# EAGLE design draaibank_2 sidesv2 (EAGLE 9.6.2)
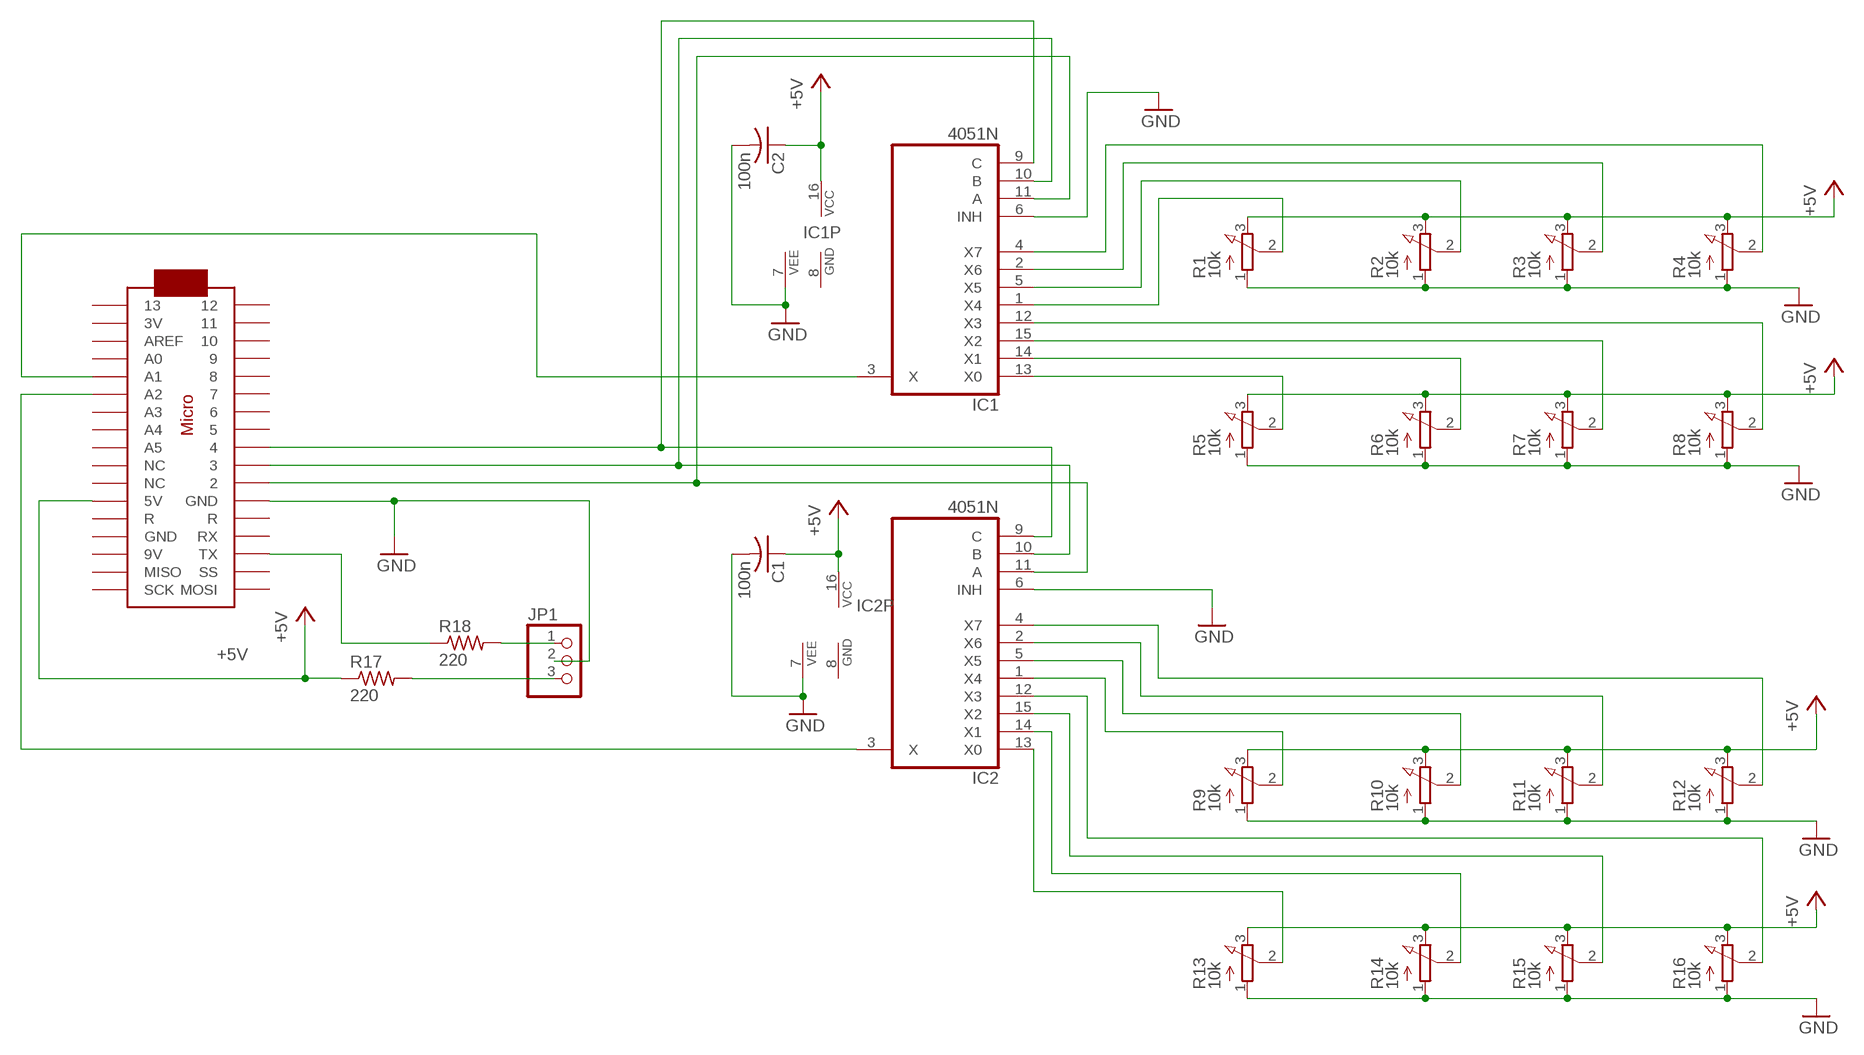
[diagram p0: schematic, sheet 1]

## Parts
C1  100n  C-USC0805  [C0805]
C2  100n  C-USC0805  [C0805]
IC1  4051N  [DIL16]
IC2  4051N  [DIL16]
JP1  PINHD-1X3  [1X03]
R1  10k  EVUF2A  [EVUF]
R2  10k  EVUF2A  [EVUF]
R3  10k  EVUF2A  [EVUF]
R4  10k  EVUF2A  [EVUF]
R5  10k  EVUF2A  [EVUF]
R6  10k  EVUF2A  [EVUF]
R7  10k  EVUF2A  [EVUF]
R8  10k  EVUF2A  [EVUF]
R9  10k  EVUF2A  [EVUF]
R10  10k  EVUF2A  [EVUF]
R11  10k  EVUF2A  [EVUF]
R12  10k  EVUF2A  [EVUF]
R13  10k  EVUF2A  [EVUF]
R14  10k  EVUF2A  [EVUF]
R15  10k  EVUF2A  [EVUF]
R16  10k  EVUF2A  [EVUF]
R17  220  R-US_R0603  [R0603]
R18  220  R-US_R0603  [R0603]
U$1  ARDUINOMICRO  [ARDUINOMICRO]

## Nets
+5V: C1.1 C2.1 IC1.16(VCC) IC2.16(VCC) R1.3(E) R2.3(E) R3.3(E) R4.3(E) R5.3(E) R6.3(E) R7.3(E) R8.3(E) R9.3(E) R10.3(E) R11.3(E) R12.3(E) R13.3(E) R14.3(E) R15.3(E) R16.3(E) R17.1 U$1.P$23(5V)
GND: C1.2 C2.2 IC1.6(INH) IC1.7(VEE) IC2.6(INH) IC2.7(VEE) JP1.2 R1.1(A) R2.1(A) R3.1(A) R4.1(A) R5.1(A) R6.1(A) R7.1(A) R8.1(A) R9.1(A) R10.1(A) R11.1(A) R12.1(A) R13.1(A) R14.1(A) R15.1(A) R16.1(A) U$1.P$21(GND)
N$1: IC2.13(X0) R13.2(S)
N$2: IC2.14(X1) R14.2(S)
N$3: IC2.15(X2) R15.2(S)
N$4: IC2.12(X3) R16.2(S)
N$5: IC2.1(X4) R9.2(S)
N$6: IC2.5(X5) R10.2(S)
N$7: IC2.2(X6) R11.2(S)
N$8: IC2.4(X7) R12.2(S)
N$9: IC1.13(X0) R5.2(S)
N$10: IC1.14(X1) R6.2(S)
N$11: IC1.15(X2) R7.2(S)
N$12: IC1.12(X3) R8.2(S)
N$13: IC1.1(X4) R1.2(S)
N$14: IC1.5(X5) R2.2(S)
N$15: IC1.2(X6) R3.2(S)
N$16: IC1.4(X7) R4.2(S)
N$17: IC1.11(A) IC2.11(A) U$1.P$11
N$18: IC1.10(B) IC2.10(B) U$1.P$10
N$19: IC1.9(C) IC2.9(C) U$1.P$9
N$20: R18.1 U$1.P$15(TX)
N$21: JP1.1 R18.2
N$22: JP1.3 R17.2
N$23: IC1.3(X) U$1.P$30(A1)
N$24: IC2.3(X) U$1.P$29(A2)
Unconnected: U$1.P$1 U$1.P$2 U$1.P$3 U$1.P$4 U$1.P$5 U$1.P$6 U$1.P$7 U$1.P$8 U$1.P$12(GND) U$1.P$13(R) U$1.P$14(RX) U$1.P$16(SS) U$1.P$17(MOSI) U$1.P$18(SCK) U$1.P$19(MISO) U$1.P$20(9V) U$1.P$22(R) U$1.P$24(NC) U$1.P$25(NC) U$1.P$26(A5) U$1.P$27(A4) U$1.P$28(A3) U$1.P$31(A0) U$1.P$32(AREF) U$1.P$33(3V) U$1.P$34

## Power pins joined to a net without a drawn wire
GND: IC1.8(GND) IC2.8(GND)

## Library data of the parts
C1 C2 = adafruit:C-US: CAPACITOR, American symbol
IC1 IC2 = 40xx:4051: 8-channel ANALOG MULTIPLEXER
JP1 = pinhead:PINHD-1X3: PIN HEADER
R1-R16 = pot:EVU: 9 mm Square Rotary Potentiometers Source: Panasonic
R17 R18 = adafruit:R-US_: RESISTOR, American symbol
U$1 = adafruit:ARDUINOMICRO

## Board
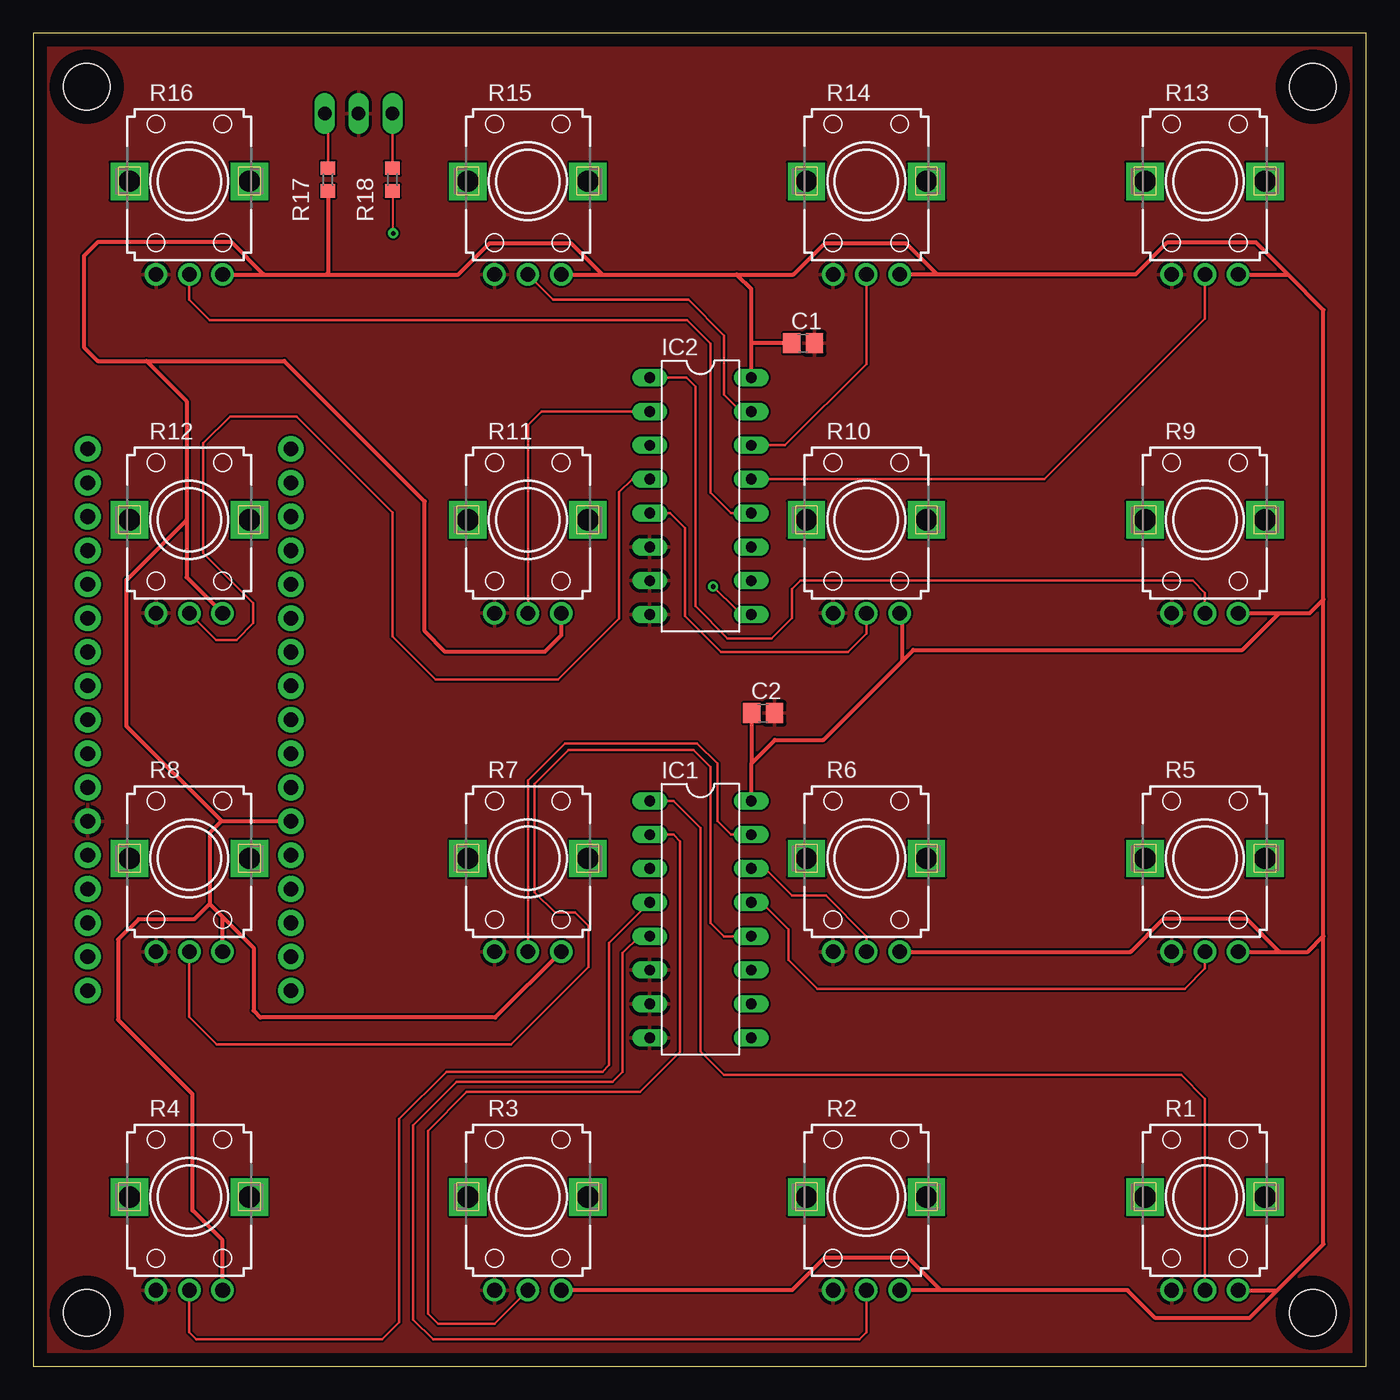
[diagram p1: board, top side]
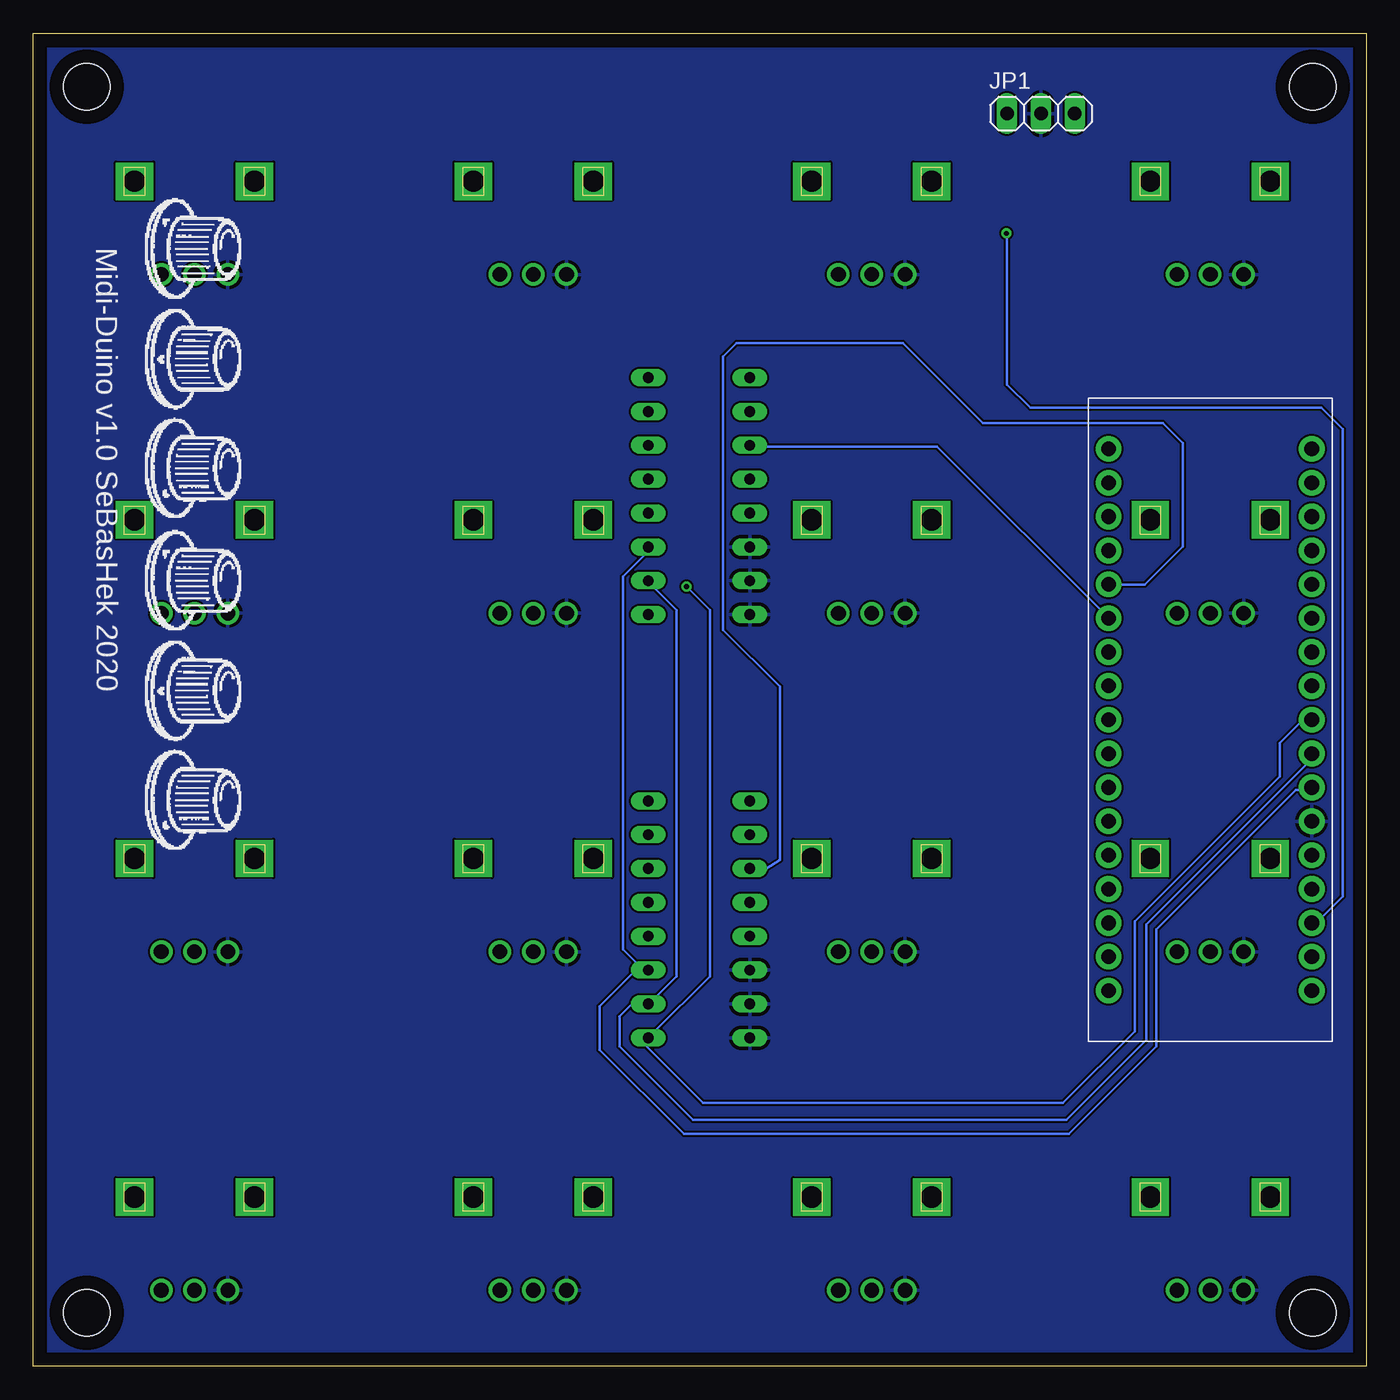
[diagram p2: board, bottom side, seen from below]

Size 100 x 100 mm. Coordinates in mm from the lower left corner, seen from the top.
Outline: 0,0 100,0 100,100 0,100 0,0
Copper layers (1*16): Top 0.035mm / dielectric 1.5mm / Bottom 0.035mm
Design rules "default *": minimum track width 6mil, minimum drill 0.35mm, track to track 6mil, track to pad 6mil, pad to pad 6mil, via to via 6mil, smd to smd 6mil, copper to edge 40mil, drill to drill 6mil, minimum pad ring 10mil, minimum via ring 8mil, stop-mask expansion 4mil, vias tented up to drill 0mil, thermal gap 10mil
Holes 3.5 mm at 4,96 96,96 96,4 4,4

### Footprints (pad centres in the part's own frame; a part is rotated, then mirrored left to right if it is on the bottom)
C0805 = smd 1.3 x 1.5: 1 -0.85,0; 2 0.85,0
DIL16 = drill 0.813 long: 1 -8.89,-3.81; 2 -6.35,-3.81; 3 -3.81,-3.81; 4 -1.27,-3.81; 5 1.27,-3.81; 6 3.81,-3.81; 7 6.35,-3.81; 8 8.89,-3.81; 9 8.89,3.81; 10 6.35,3.81; 11 3.81,3.81; 12 1.27,3.81; 13 -1.27,3.81; 14 -3.81,3.81; 15 -6.35,3.81; 16 -8.89,3.81
1X03 = drill 1.016 long: 1 -2.54,0; 2 0,0; 3 2.54,0
EVUF = drill 1.1 pad 1.676: 1 -2.5,-7; 2 0,-7; 3 2.5,-7 | drill 1.6 pad 2.8 square: M1 4.5,0; M2 -4.5,0
R0603 = smd 1 x 1.1: 1 -0.85,0; 2 0.85,0
ARDUINOMICRO = drill 1.1 pad 1.93: P$1 -20.32,7.62; P$2 -17.78,7.62; P$3 -15.24,7.62; P$4 -12.7,7.62; P$5 -10.16,7.62; P$6 -7.62,7.62; P$7 -5.08,7.62; P$8 -2.54,7.62; P$9 0,7.62; P$10 2.54,7.62; P$11 5.08,7.62; P$12 12.7,-7.62; P$13 10.16,-7.62; P$14 12.7,7.62; P$15 15.24,7.62; P$16 17.78,7.62; P$17 20.32,7.62; P$18 20.32,-7.62; P$19 17.78,-7.62; P$20 15.24,-7.62; P$21 7.62,7.62; P$22 10.16,7.62; P$23 7.62,-7.62; P$24 5.08,-7.62; P$25 2.54,-7.62; P$26 0,-7.62; P$27 -2.54,-7.62; P$28 -5.08,-7.62; P$29 -7.62,-7.62; P$30 -10.16,-7.62; P$31 -12.7,-7.62; P$32 -15.24,-7.62; P$33 -17.78,-7.62; P$34 -20.32,-7.62

### Placement (x,y rotation side)
C1  57.75,76.75 0 top
C2  54.75,49 0 top
IC1  50.05,33.53 270 top
IC2  50.05,65.28 270 top
JP1  24.4,93.98 0 bottom
R1  87.9,12.7 0 top
R2  62.5,12.7 0 top
R3  37.1,12.7 0 top
R4  11.7,12.7 0 top
R5  87.9,38.1 0 top
R6  62.5,38.1 0 top
R7  37.1,38.1 0 top
R8  11.7,38.1 0 top
R9  87.9,63.5 0 top
R10  62.5,63.5 0 top
R11  37.1,63.5 0 top
R12  11.7,63.5 0 top
R13  87.9,88.9 0 top
R14  62.5,88.9 0 top
R15  37.1,88.9 0 top
R16  11.7,88.9 0 top
R17  22.11,89.03 90 top
R18  26.94,89.03 90 top
U$1  11.7,48.5 270 bottom

### Tracks (layer width: path | path; a pad name or v marks a point on that pad's centre or on a via)
+5V
  Top 0.152: C2.1 53.86,49 | 22.11,82.01 22,81.9
  Top 0.305: R13.3 94.14,81.9 | 94.14,81.9 96.79,79.25 96.79,57.52 | R9.3 93.49,56.5 | 93.49,56.5 95.77,56.5 96.79,57.52 | R5.3 93.49,31.1 | 93.49,31.1 95.62,31.1 96.79,32.27 | 96.79,32.27 96.79,57.52 | R1.3 93.33,5.7 | 93.33,5.7 96.79,9.16 96.79,32.27 | R6.3 82.34,31.1 84.82,33.58 91.01,33.58 93.49,31.1 | 68.09,5.7 82.09,5.7 84.19,3.6 91.23,3.6 93.33,5.7 | 68.09,5.7 R2.3 | R3.3 56.93,5.7 59.41,8.18 65.61,8.18 68.09,5.7 | 67.83,81.9 82.68,81.9 85.1,84.32 91.72,84.32 94.14,81.9 | 67.83,81.9 R14.3 | R15.3 42.69,81.9 | 42.69,81.9 52.76,81.9 | 52.76,81.9 57.02,81.9 59.38,84.25 65.48,84.25 67.83,81.9 | R10.3 65.2,56.3 65.2,52.92 | R16.3 17.29,81.9 | 17.29,81.9 22,81.9 31.88,81.9 34.23,84.25 40.34,84.25 42.69,81.9 | 8.49,75.41 4.84,75.41 3.78,76.47 3.78,83.28 4.82,84.32 14.87,84.32 17.29,81.9 | R8.3 14.2,33.7 | 13.22,34.68 14.2,33.7 | 13.22,34.68 13.22,39.99 14.12,40.89 | U$1.P$23 14.13,40.88 14.12,40.89 | R7.3 34.66,26.16 17.03,26.16 16.51,26.68 16.51,31.39 14.2,33.7 | R4.3 14.2,9.44 11.95,11.68 11.95,20.41 6.37,26 6.37,32 7.89,33.53 12.08,33.53 13.22,34.68 | R11.3 39.6,54.82 38.37,53.59 30.91,53.59 29.36,55.14 29.36,64.88 18.83,75.41 8.49,75.41 | IC2.16 53.86,76.75 | 53.86,76.75 53.86,80.8 52.76,81.9 | IC1.16 53.86,45.21 | 53.86,45.21 55.64,46.99 59.27,46.99 65.2,52.92 | 65.2,52.92 66.02,53.73 90.72,53.73 93.49,56.5 | 8.49,75.41 11.5,72.4 11.5,63.5 | 14.12,40.89 7,48.01 7,59 11.5,63.5 | 11.5,63.5 11.5,59.2 R12.3 | 53.86,49 53.86,45.21 | C1.1 53.86,76.75 | R17.1 22.11,82.01
GND
  pour Top: 0.25,99.68 0.25,0.25 99.75,0.25 99.75,99.68
  pour Bottom: 1,1 99,1 99,99 1,99
N$1
  Top 0.2: R13.2 87.9,78.6 75.85,66.55 IC2.13
N$2
  Top 0.2: R14.2 62.5,75.18 56.4,69.09 IC2.14
N$3
  Top 0.2: R15.2 38.99,80.01 49.16,80.01 51.83,77.34 51.83,72.9 53.1,71.63 IC2.15
N$4
  Top 0.2: R16.2 11.7,80.01 13.22,78.49 49.04,78.49 50.82,76.71 50.82,65.53 52.34,64.01 IC2.12
N$5
  Top 0.2: IC2.1 48.99,74.17 49.68,73.48 49.68,57.02 52.09,54.61 55.39,54.61 56.91,56.13 56.91,58.3 57.56,58.95 86.98,58.95 87.9,58.02 R9.2
N$6
  Top 0.2: R10.2 62.5,54.98 61.12,53.59 51.59,53.59 48.91,56.27 48.91,62.87 47.77,64.01 IC2.5
N$7
  Top 0.2: R11.2 37.1,70.61 38.12,71.63 IC2.2
N$8
  Top 0.2: R12.2 13.7,54.5 15.25,54.5 16.5,55.75 16.5,57.25 12.75,61 12.75,69.25 14.75,71.25 19.75,71.25 26.95,64.05 26.95,54.75 30.17,51.53 39.39,51.53 43.96,56.11 43.96,65.57 44.94,66.55 IC2.4
N$9
  Top 0.2: R5.2 87.9,29.83 86.38,28.31 58.82,28.31 56.66,30.48 56.66,32.77 54.63,34.8 IC1.13
N$10
  Top 0.2: IC1.14 54.88,37.34 56.91,35.31 59.45,35.31 62.5,32.26 R6.2
N$11
  Top 0.2: R7.2 37.1,43.94 39.89,46.74 49.8,46.74 51.33,45.21 51.33,40.89 52.34,39.88 IC1.15
N$12
  Top 0.2: IC1.12 51.83,32.26 50.82,33.27 50.82,44.95 49.55,46.23 40.15,46.23 37.61,43.69 37.61,35.56 39.13,34.04 40.66,34.04 41.67,33.02 41.67,29.97 35.84,24.14 13.77,24.14 11.7,26.21 R8.2
N$13
  Top 0.2: IC1.1 48.02,42.42 50.06,40.38 50.06,23.62 51.83,21.84 86.12,21.84 87.9,20.07 R1.2
N$14
  Top 0.2: IC1.5 45.48,32.26 44.21,30.99 44.21,22.1 43.45,21.34 31.77,21.34 28.5,18.07 28.5,3.5 29.98,2.02 61.99,2.02 62.5,2.54 R2.2
N$15
  Top 0.2: R3.2 34.6,3.2 30.35,3.2 29.6,3.95 29.6,17.68 32.5,20.57 45.52,20.57 48.53,23.59 48.53,39.37 48.02,39.88 IC1.2
N$16
  Top 0.2: IC1.4 43.2,31.75 43.2,22.61 42.69,22.1 31.01,22.1 27.45,18.54 27.45,3.29 26.19,2.02 12.22,2.02 11.7,2.54 R4.2
N$17
  Bottom 0.2: IC2.11 54,61 55.75,59.25 55.75,31.25 54.22,29.72 IC1.11 54.78,29.72 57.51,26.99 57.51,23.74 51.19,17.42 22.31,17.42 15.73,24 15.73,32.79 5.27,43.25 4.48,43.25 U$1.P$11
N$18
  Bottom 0.2: IC2.10 53.5,58.5 51.75,56.75 51.75,29.25 53.5,27.5 IC1.10 55.07,27.18 56,26.25 56,24 50.5,18.5 22.5,18.5 16.5,24.5 16.5,33.14 4.08,45.56 U$1.P$10
N$19  (via drill 0.35)
  Top 0.2: v51,58.5 52.78,56.72 IC2.9
  Bottom 0.2: 53.5,25 49.25,29.25 49.25,56.75 v51,58.5 | 53.5,25 54.25,24.25 49.75,19.75 22.75,19.75 17.38,25.12 17.38,33.38 6.5,44.25 6.5,46.75 4.75,48.5 U$1.P$9 | 53.5,25 IC1.9
N$20  (via drill 0.35)
  Top 0.152: v27,85 27,88 R18.1
  Bottom 0.2: U$1.P$15 3.73,33.26 1.74,35.25 1.74,70.3 3.36,71.92 25.21,71.92 26.94,73.65 26.94,84.94 v27,85
N$21
  Top 0.2: R18.2 JP1.1
N$22
  Top 0.2: JP1.3 22.11,93.73 R17.2
N$23
  Bottom 0.2: IC1.3 44.99,37.34 44,38 44,51 48.25,55.25 48.25,75.75 47.25,76.75 34.75,76.75 28.75,70.75 15.25,70.75 13.75,69.25 13.75,61.5 16.59,58.66 U$1.P$30
N$24
  Bottom 0.2: U$1.P$29 32.2,69 46,69 IC2.3

### Text on the board
bPlace: Midi-Duino v1.0 SeBasHek 2020